# Altium schematic sheet 电源电路.SchDoc
size A4
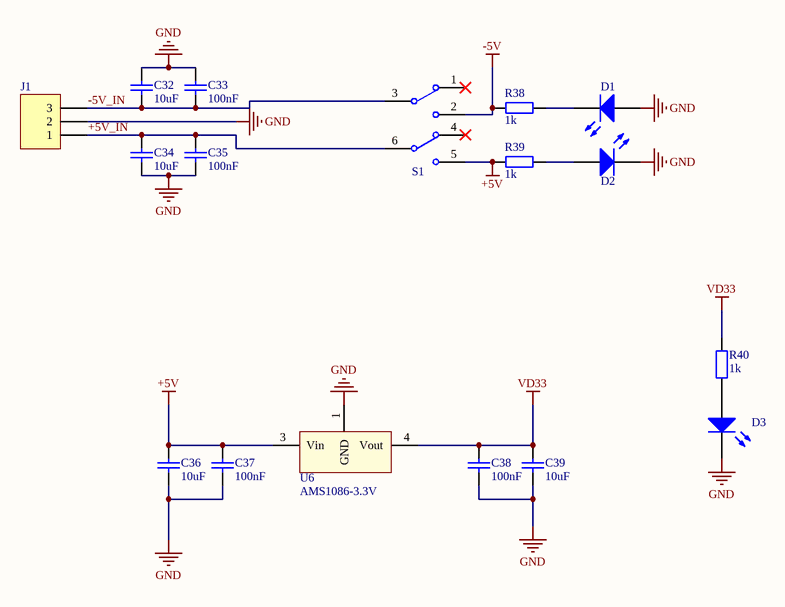
[diagram p0: 电源电路.SchDoc]

## Parts
C32  10uF  [LC-0805_C]
C33  100nF  [LC-0805_C]
C34  10uF  [LC-0805_C]
C35  100nF  [LC-0805_C]
C36  10uF  [LC-0805_C]
C37  100nF  [LC-0805_C]
C38  100nF  [LC-0805_C]
C39  10uF  [LC-0805_C]
D1  LED0  [0805-POLAR]  (value not drawn)
D2  LED0  [0805-POLAR]  (value not drawn)
D3  LED0  [0805-POLAR]  (value not drawn)
J1  ������  [HDR1X3]  (value not drawn)
R38  1k  [LC-0805_R]
R39  1k  [LC-0805_R]
R40  1k  [LC-0805_R]
S1  ��������  [DPDT-6]  (value not drawn)
U6  AMS1086-3.3V  [TO-252]

## Nets
+5V: C36.1 C37.1 R39.1 S1.5 U6.3(Vin)
-5V: R38.1 S1.2
GND: C32.1 C33.1 C34.2 C35.2 C36.2 C37.2 C38.2 C39.2 D1.1(A) D2.2(K) D3.2(K) J1.2 U6.1(GND)
VD33: C38.1 C39.1 R40.2 U6.4(Vout)
+5V_IN: C34.1 C35.1 J1.1 S1.6
-5V_IN: C32.2 C33.2 J1.3 S1.3
NetD1_2: D1.2(K) R38.2
NetD2_1: D2.1(A) R39.2
NetD3_1: D3.1(A) R40.1

Not connected (* = marked no-connect by the designer): S1 1* 4*

## Library data of the parts
C32-C39 = Cap: 100nF��0805��50V,+/-10%
D1-D3 = LED0: ��������ܣ�0805���׷��̹�; Published: 8-Jun-2000; LatestRevisionDate: 08-Jul-2005; LatestRevisionNote: Mech Layer 1 removed.; PackageReference: LED-0; Publisher: Altium Limited; PackageDescription: LED; 2 Leads
J1 = Header 3: 1*3Pin,2.54mm��൥����; LatestRevisionDate: 17-Jul-2002; LatestRevisionNote: Re-released for DXP Platform.; Publisher: Altium Limited
R38-R40 = R: 10k��,0805,��5%
S1 = SW-6: 8*8mm����˫·��������
U6 = AMS1086-3.3: AMS1086-3.3V,TO252��װ